# EAGLE design zxdos_ps2_usd (EAGLE 7.3.0)
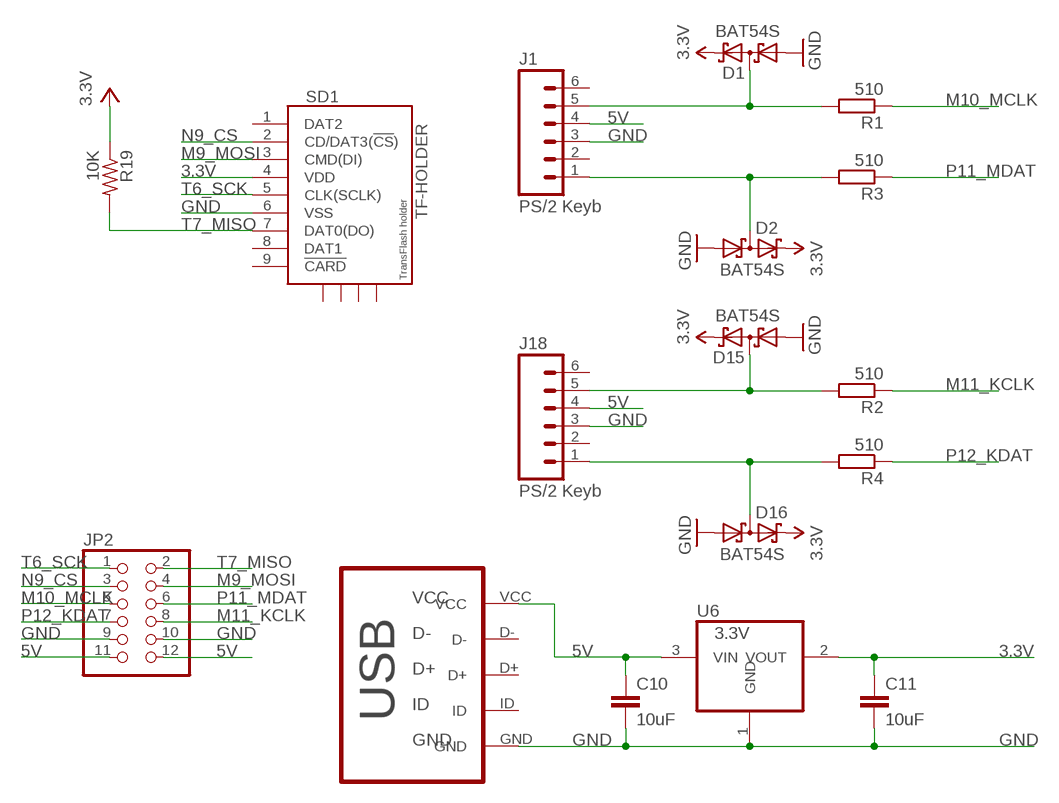
[diagram p0: schematic, sheet 1]

## Parts
C10  10uF  C-EUC0805K  [C0805K]
C11  10uF  C-EUC0805K  [C0805K]
D1  BAT54S  [SOT23]
D2  BAT54S  [SOT23]
D15  BAT54S  [SOT23]
D16  BAT54S  [SOT23]
J1  PS/2 Keyb  DINC_MIN_TM_6_1  [DINC/MIN_TM/6_1PRIMARY]
J17  MICRO-USB-B  [MICRO_USB_4_LEGS]
J18  PS/2 Keyb  DINC_MIN_TM_6_1  [DINC/MIN_TM/6_1PRIMARY]
JP2  PINHD-2X6  [2X06]
R1  510  R-EU_R0805  [R0805]
R2  510  R-EU_R0805  [R0805]
R3  510  R-EU_R0805  [R0805]
R4  510  R-EU_R0805  [R0805]
R19  10K  R-US_R0805  [R0805]
SD1  TF-HOLDER  [TF-PULL]
U6  3.3V  REG1117  [SOT223]

## Nets
3.3V [power]: C11.1 D1.2(C2) D2.2(C2) D15.2(C2) D16.2(C2) R19.1 SD1.4(VDD) U6.2(VOUT)
5V: C10.1 J1.4 J17.VCC J18.4 JP2.11 JP2.12 U6.3(VIN)
GND [power]: C10.2 C11.2 D1.1(A1) D2.1(A1) D15.1(A1) D16.1(A1) J1.3 J17.GND J18.3 JP2.9 JP2.10 SD1.6(VSS) U6.1(GND)
M9_MOSI: JP2.4 SD1.3(CMD(DI))
M10_MCLK: JP2.5 R1.1
M11_KCLK: JP2.8 R2.1
N9_CS: JP2.3 SD1.2(CD/DAT3(!CS!))
N$1: D1.3(C1A2) J1.5 R1.2
N$2: D2.3(C1A2) J1.1 R3.2
N$4: D15.3(C1A2) J18.5 R2.2
N$8: D16.3(C1A2) J18.1 R4.2
P11_MDAT: JP2.6 R3.1
P12_KDAT: JP2.7 R4.1
T6_SCK: JP2.1 SD1.5(CLK(SCLK))
T7_MISO: JP2.2 R19.2 SD1.7(DAT0(DO))
Unconnected: J1.2 J1.6 J17.D+ J17.D- J17.ID J18.2 J18.6 SD1.1(DAT2) SD1.8(DAT1) SD1.9(!CARD) SD1.S1 SD1.S2 SD1.S3 SD1.S4

## Library data of the parts
C10 C11 = rcl:C-EU: CAPACITOR, European symbol
D1 D2 D15 D16 = diode:BAT54S: Schottky Diodes Pin connection corrected 2011-05-04 Source: Fairchild .. BAT54.pdf
J1 J18 = ZX_UNO_0_14:DINC_MIN_TM_6_1
J17 = micro usb B - 4LEGS:MICRO-USB-B
JP2 = pinhead:PINHD-2X6: PIN HEADER
R1-R4 = rcl:R-EU_: RESISTOR, European symbol
R19 = rcl:R-US_: RESISTOR, American symbol
SD1 = sd-mmc:TF-HOLDER: TF / Micro SD socket is PUSH-PUSH type, the card can be pushed into and auto locked and pushed out by simply press the card. Surface Mounting type.
U6 = burr-brown:REG1117: 800mA and 1A Low Dropout (LDO) Positive Regulator 1.8V, 2.5V, 2.85V, 3.3V, 5V, and Adj; MPN: REG1117; OC_FARNELL: 1097566; OC_NEWARK: 14P6981

## Net classes
0 default: width 0.178 mm, clearance 0.178 mm
1 power: width 0.305 mm, clearance 0.178 mm to class 0, clearance 0.229 mm

## Board
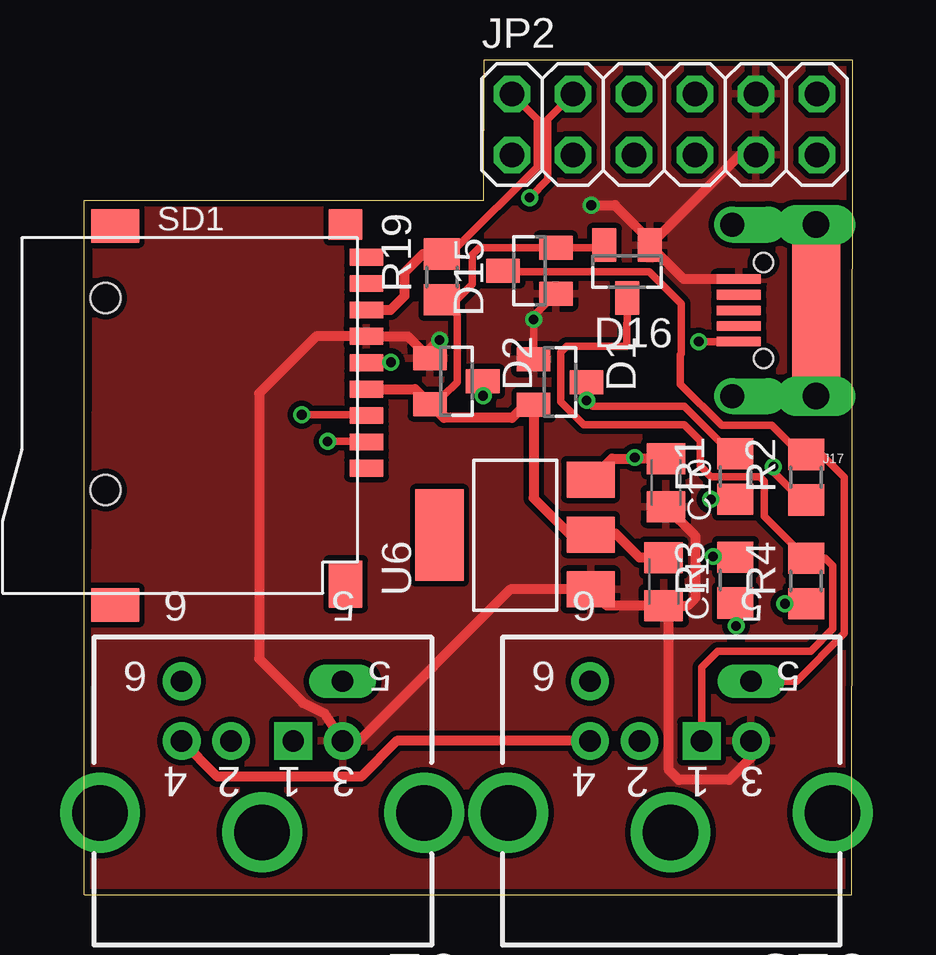
[diagram p1: board, top side]
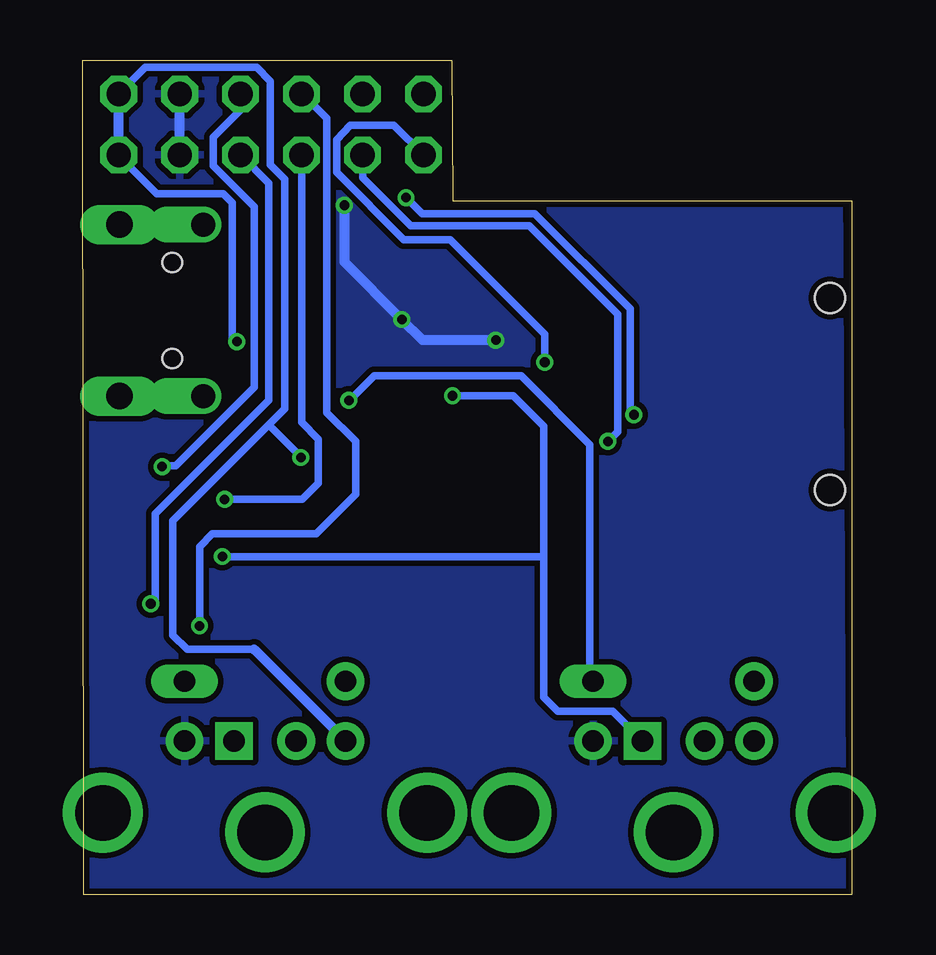
[diagram p2: board, bottom side, seen from below]

Size 32.04 x 34.77 mm. Coordinates in mm from the lower left corner, seen from the top.
Outline: 0.03,0 32,0 32.04,34.77 16.67,34.77 16.64,28.92 0,28.92 0,0
Copper layers (1*16): Top 0.035mm / dielectric 1.5mm / Bottom 0.035mm
Design rules "seedstudio_Fusion_eagle_rule_v1.1": minimum track width 6mil, minimum drill 12mil, track to track 6mil, track to pad 6mil, pad to pad 6mil, via to via 6mil, smd to smd 0mil, copper to edge 10mil, drill to drill 10mil, minimum pad ring 10mil, minimum via ring 6mil, stop-mask expansion 2mil, vias tented up to drill 100mil, thermal gap 10mil

### Footprints (pad centres in the part's own frame; a part is rotated, then mirrored left to right if it is on the bottom)
C0805K = smd 1.3 x 1.6: 1 -1,0; 2 1,0
SOT23 = smd 1 x 1.4: 1 -0.95,-1.1; 2 0.95,-1.1; 3 0,1.1
DINC/MIN_TM/6_1PRIMARY = drill 0.889 pad 1.575 square: 1 -1.295,-8.509 | drill 0.889 pad 1.575: 2 1.295,-8.509; 3 -3.353,-8.509; 4 3.353,-8.509; 6 3.353,-10.998 | drill 0.889 pad 1.194 long: 5 -3.353,-10.998 | drill 2.311 pad 2.845: 7 -6.756,-5.512; 8 0,-4.699; 9 6.756,-5.512
MICRO_USB_4_LEGS = smd 1.85 x 0.4: D+ 3.125,0; D- 3.125,0.65; GND 3.125,-1.3; ID 3.125,-0.65; VCC 3.125,1.3 | drill 1.1 pad 1.5 long: P$1 -0.1,3.575; P$2 -0.1,-3.575 | drill 1 pad 1.5 offset: P$3 3.4,3.575; P$5 3.4,-3.575 | smd 2 x 6: P$4 -0.1,0 | hole 0.8: 2.1,2; 2.1,-2
2X06 = drill 1.016 octagon: 1 -6.35,-1.27; 2 -6.35,1.27; 3 -3.81,-1.27; 4 -3.81,1.27; 5 -1.27,-1.27; 6 -1.27,1.27; 7 1.27,-1.27; 8 1.27,1.27; 9 3.81,-1.27; 10 3.81,1.27; 11 6.35,-1.27; 12 6.35,1.27
R0805 = smd 1.3 x 1.5: 1 -0.95,0; 2 0.95,0
TF-PULL = smd 0.7 x 1.4: 1 -2.2,-7.62; 2 -1.1,-7.62; 3 0,-7.62; 4 1.1,-7.62; 5 2.2,-7.62; 6 3.3,-7.62; 7 4.4,-7.62; 8 5.5,-7.62; 9 6.6,-7.62 | smd 1.4 x 2: S1 -7.9,2.85; S2 7.9,2.85 | smd 1.28 x 1.4: S3 7.96,-6.75 | smd 1.95 x 1.4: S4 -7.025,-6.75 | hole 1.25: -3.1,3.25; 4.9,3.25
SOT223 = smd 1.499 x 2.007: 1 -2.261,-3.15; 2 0.025,-3.15; 3 2.311,-3.15 | smd 3.81 x 2.007: 4 0,3.15

### Placement (x,y rotation side)
C10  24.26,17.18 270 top
C11  24.16,13.05 270 top
D1  19.84,21.37 270 top
D2  15.53,21.4 270 top
D15  18.57,26 90 top
D16  22.64,25.97 180 top
J1  7.43,-2.1 180 top
J17  30.42,24.35 180 top
J18  24.45,-2.1 180 top
JP2  24.19,32.1 0 top
R1  27.15,17.43 90 top
R2  30.1,17.4 90 top
R3  27.15,13.11 90 top
R4  30.1,13.08 90 top
R19  14.92,25.75 90 top
SD1  4.16,19.97 90 top
U6  17.97,14.99 90 top

### Tracks (layer width: path | path; a pad name or v marks a point on that pad's centre or on a via)
3.3V
  Top 0.305: D15.2 16.48,26.95 16.19,26.67 16.19,25.43 15.59,24.83 14.95,24.83 R19.1 15.56,24.16 15.56,21.37 14.95,20.77 14.74,20.77 D2.2 | D15.2 19.67,27.1 | D15.2 21.57,26.95 D16.2
  Top 0.406: C11.1 23.16,14.05 22.16,15.05 21.16,15.05 U6.2 21.03,14.92 20.35,14.92 18.74,16.53 D1.2 18.39,20.42 17.84,19.88 15,19.88 D2.2 13.8,21.07 SD1.4 | R19.1 14.92,24.51 14.99,24.45
5V  (via drill 0.4)
  Top 0.305: v25.62,23.05 J17.VCC
  Top 0.406: U6.3 22,18.18 22.91,18.18 v22.95,18.22 23,18.18 C10.1 | J18.4 13.05,6.41 11.56,4.92 5.57,4.92 J1.4
  Bottom 0.305: 30.57,30.8 30.54,30.8 28.96,29.21 26.19,29.21 25.81,28.83 25.81,23.24 v25.62,23.05 | 24.91,10.22 27.69,10.22 28.29,10.83 28.29,15.59 24.29,19.59 | 22.99,18.19 v22.95,18.22 22.95,18.26 24.29,19.59 | 24.29,19.59 23.62,20.26 23.62,29.81 24.23,30.42 24.23,33.91 24.8,34.48 29.43,34.48 JP2.12
  Bottom 0.406: 24.91,10.22 J18.4 | 30.57,30.8 JP2.11 JP2.12
GND  (via drill 0.4)
  Top 0.305: 18.71,22.35 D1.1 v18.74,23.97 18.74,24.12 D15.1 | D2.1 14.43,22.71
  Top 0.406: C11.2 21.8,12.05 U6.1 17.77,12.72 11.43,6.38 10.81,6.38 J1.3 10.02,7.56 9.14,8 7.3,9.84 7.3,20.89 9.68,23.27 SD1.6 13.51,23.27 D2.1 | C11.2 25.16,12.05 25.5,12.38 25.5,14.94 C10.2 | J18.3 27.8,5.7 26.89,4.79 24.8,4.79 24.38,5.21 24.38,11.83 C11.2 | JP2.9 27.35,30.83 D16.1 | J17.GND 25.01,25.65 D16.1 | v21.14,28.73 22.13,28.73 23.34,27.53 23.34,27.32 D16.1 | 14.43,22.71 v14.83,23.11
  Bottom 0.406: JP2.9 JP2.10 | v14.83,23.11 17.89,23.11 v18.74,23.97 21.14,26.37 v21.14,28.73
  pour Bottom: 0.54,34.45 31.88,34.58 31.65,0.25 0.38,0.16
  pour Top: 0.54,34.42 31.75,34.54 31.65,0.25 0.41,0.13
M9_MOSI  (via drill 0.4)
  Top 0.305: v9.08,20 11.75,20 SD1.3 | JP2.4 19.34,32.32 19.34,29.81 v18.57,29.05
  Bottom 0.305: v9.08,20 9.24,20.16 9.24,24.42 13.21,28.38 17.91,28.38 v18.57,29.05 18.54,28.86
M10_MCLK  (via drill 0.4)
  Top 0.305: R1.1 v26.13,16.48
  Bottom 0.305: v26.13,16.48 22.89,16.48 22.23,17.14 22.23,18.99 22.92,19.68 JP2.5
M11_KCLK  (via drill 0.4)
  Top 0.305: v28.73,17.84 28.73,17.62 29.91,16.45 R2.1
  Bottom 0.305: JP2.8 25.46,32.7 26.61,31.56 26.61,30.39 24.89,28.67 24.89,21.14 28.16,17.88 28.7,17.88 v28.73,17.84
N9_CS  (via drill 0.4)
  Top 0.305: v10.16,18.89 11.76,18.89 SD1.2
  Bottom 0.305: v10.16,18.89 9.75,19.3 9.75,24.19 13.43,27.88 18.38,27.88 20.38,29.88 JP2.3
N$1  (via drill 0.4)
  Top 0.305: D1.3 v20.94,20.62 v20.95,20.61 21.21,20.35 25.02,20.35 26.64,18.73 26.79,18.73 R1.2
  Bottom 0.305: v20.95,20.61 20.92,20.61 19.91,21.62 13.78,21.62 10.92,18.76 10.92,9.04 J1.5
N$2  (via drill 0.4)
  Top 0.305: R3.2 26.26,14.06 v26.23,14.1 | v16.64,20.8 16.64,21.39 D2.3
  Bottom 0.305: 12.83,14.13 12.83,19.53 14.1,20.8 v16.64,20.8 | 12.83,14.13 12.83,8.22 12.26,7.65 9.96,7.65 J1.1 | v26.23,14.1 12.86,14.1 12.83,14.13
N$4
  Top 0.305: J18.5 29.7,8.9 31.69,10.89 31.69,17.4 30.77,18.32 30.13,18.32 R2.2 | 30.53,18.78 R2.2 | R2.2 30.29,18.35 30.39,18.26 29.97,18.26 28.67,19.56 26.57,19.56 24.86,21.27 24.86,22.51 24.89,22.54 24.89,24.64 23.56,25.97 17.51,25.97 D15.3
N$8
  Top 0.305: J18.1 25.75,9.49 26.42,10.16 30.29,10.16 31.21,11.08 31.21,13.72 30.89,14.03 R4.2 28.35,15.78 28.35,17.24 28.16,17.43 26.13,17.43 25.69,17.88 25.69,18.92 25.02,19.59 20.83,19.59 19.88,20.54 19.88,22.61 20.13,22.86 22.62,22.86 D16.3
P11_MDAT  (via drill 0.4)
  Top 0.305: v27.18,11.21 27.18,12.13 R3.1
  Bottom 0.305: v27.18,11.21 27.18,14.51 26.64,15.05 22.32,15.05 20.67,16.7 20.67,18.89 21.88,20.1 21.88,32.35 22.89,33.37 JP2.6
P12_KDAT  (via drill 0.4)
  Top 0.305: v29.21,12.13 R4.1
  Bottom 0.305: JP2.7 24.29,29.65 24.29,20.61 29.02,15.88 29.02,12.32 v29.21,12.13
T6_SCK  (via drill 0.4)
  Top 0.305: SD1.5 12.76,22.16 v12.79,22.19
  Bottom 0.305: JP2.1 19.08,32.07 20.89,32.07 21.46,31.46 21.46,30.1 18.67,27.3 16.73,27.3 12.79,23.37 v12.79,22.19
T7_MISO
  Top 0.305: JP2.2 18.89,32.32 18.89,30.32 15.53,26.96 15.18,26.96 R19.2
  Top 0.406: SD1.7 12.78,24.37 13.37,24.96 13.37,25.94 14.13,26.7 R19.2